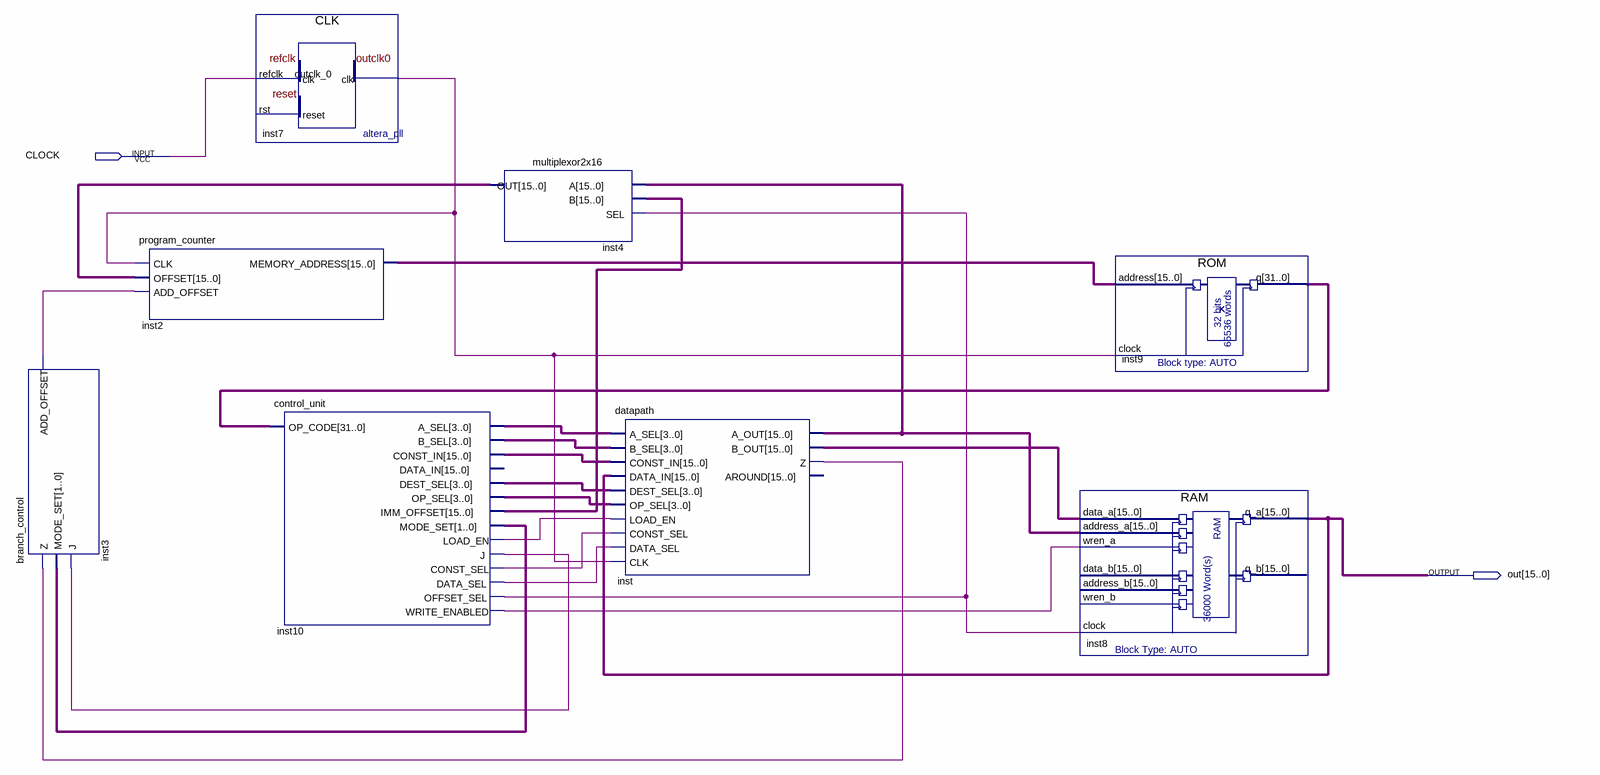
[diagram p0: schematic sheet]
// Quartus schematic Circuit.bdf as structural Verilog: 8 symbols, 2 pins
module Circuit (
  input  CLOCK,
  output [15:0] out
);

  wire inst3_add_offset, inst7_outclk_0, inst10_const_sel, inst10_data_sel, inst10_j, inst10_load_en,
       inst10_offset_sel, inst10_write_enabled, inst_z;
  wire [1:0] inst10_mode_set;
  wire [3:0] inst10_a_sel, inst10_b_sel, inst10_dest_sel, inst10_op_sel;
  wire [15:0] inst2_memory_address, inst4_out, inst10_const_in, inst10_imm_offset, inst_a_out, inst_b_out;
  wire [31:0] inst9_q;

  branch_control inst3 (.Z(inst_z), .MODE_SET(inst10_mode_set), .J(inst10_j), .ADD_OFFSET(inst3_add_offset));
  program_counter inst2 (
    .CLK(inst7_outclk_0), .OFFSET(inst4_out), .ADD_OFFSET(inst3_add_offset),
    .MEMORY_ADDRESS(inst2_memory_address));
  CLK inst7 (.refclk(CLOCK), .outclk_0(inst7_outclk_0));  // open: rst
  control_unit inst10 (
    .OP_CODE(inst9_q), .A_SEL(inst10_a_sel), .B_SEL(inst10_b_sel), .CONST_IN(inst10_const_in),
    .DEST_SEL(inst10_dest_sel), .OP_SEL(inst10_op_sel), .IMM_OFFSET(inst10_imm_offset),
    .MODE_SET(inst10_mode_set), .LOAD_EN(inst10_load_en), .J(inst10_j), .CONST_SEL(inst10_const_sel),
    .DATA_SEL(inst10_data_sel), .OFFSET_SEL(inst10_offset_sel), .WRITE_ENABLED(inst10_write_enabled));  // open: DATA_IN
  multiplexor2x16 inst4 (.A(inst_a_out), .B(inst10_imm_offset), .SEL(inst10_offset_sel), .OUT(inst4_out));
  datapath inst (
    .A_SEL(inst10_a_sel), .B_SEL(inst10_b_sel), .CONST_IN(inst10_const_in), .DATA_IN(out),
    .DEST_SEL(inst10_dest_sel), .OP_SEL(inst10_op_sel), .LOAD_EN(inst10_load_en),
    .CONST_SEL(inst10_const_sel), .DATA_SEL(inst10_data_sel), .CLK(inst7_outclk_0), .A_OUT(inst_a_out),
    .B_OUT(inst_b_out), .Z(inst_z));  // open: AROUND
  RAM inst8 (
    .data_a(inst_b_out), .address_a(inst_a_out), .wren_a(inst10_write_enabled), .clock(inst10_offset_sel),
    .q_a(out));  // open: data_b, address_b, wren_b, q_b
  ROM inst9 (.address(inst2_memory_address), .clock(inst7_outclk_0), .q(inst9_q));
endmodule
